# Altium schematic sheet Sheet1.SchDoc
size A; SheetNumber: 1; SheetTotal: 1
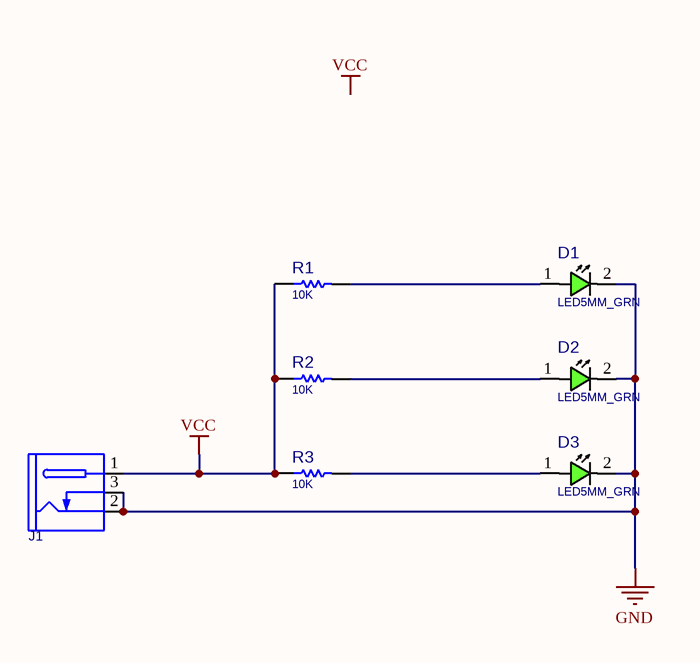
[diagram p0: Sheet1.SchDoc]

## Parts
D1  LED5MM_GRN  [LED5MM_GRN]
D2  LED5MM_GRN  [LED5MM_GRN]
D3  LED5MM_GRN  [LED5MM_GRN]
J1  DC_POWER_JACK  [JAC_PWR1]  (value not drawn)
R1  10K  [R025W_AX04]
R2  10K  [R025W_AX04]
R3  10K  [R025W_AX04]

## Nets
GND: D1.2(CATHODE) D2.2(CATHODE) D3.2(CATHODE) J1.2(SLEEVE) J1.3(INSERTION_DET)
VCC: J1.1(TIP) R1.1 R2.1 R3.1
NetD1_1: D1.1(ANODE) R1.2
NetD2_1: D2.1(ANODE) R2.2
NetD3_1: D3.1(ANODE) R3.2

## Notes on the sheet
- Labels drawn without touching a wire or pin: VCC

## Library data of the parts
D1-D3 = LED_THD_5MM_GRN: LED, THD, 5MM, GREEN; DESC: DESCRIPTION; MANF_P#: MANF_PART#; PARAM2: 2.2V; MANF: MANF; ASSEMBLY: ASSEMBLY; PRICE: PRICE; VALUE: LED5MM_GRN
J1 = CONN_PWR_JACKR1: CONN, PWR JACK DC, PLUG DIAM 1.0MM RA THD; MANF: CUI STACK; MANF_P#: PJ-031CH, PJ-031C; PARAM: CH 3A, C 2A; VALUE: DC_POWER_JACK
R1-R3 = RES_THD: RESISTOR, THD; MANF_P#: RK73H1ETTP4701F; MANF: KOA SPEER; PARAM: 0.063W; DESC: DESCRIPTION; DIST#: MOUSER; PARAM2: 1%; ASSEMBLY: ASSEMBLY; PRICE: 100= 0.5$; VALUE: 10K